# Altium schematic sheet MCU.SchDoc: Smart Bus Ticketing Machine/MCU
size A4; Date: 3/10/2025; CheckedBy: Kiran Gunathilaka; Author: Kiran Gunathilaka; DrawnBy: Kiran Gunathilaka; DocumentNumber: 02; Revision: v1.1; SheetNumber: 2; SheetTotal: 11
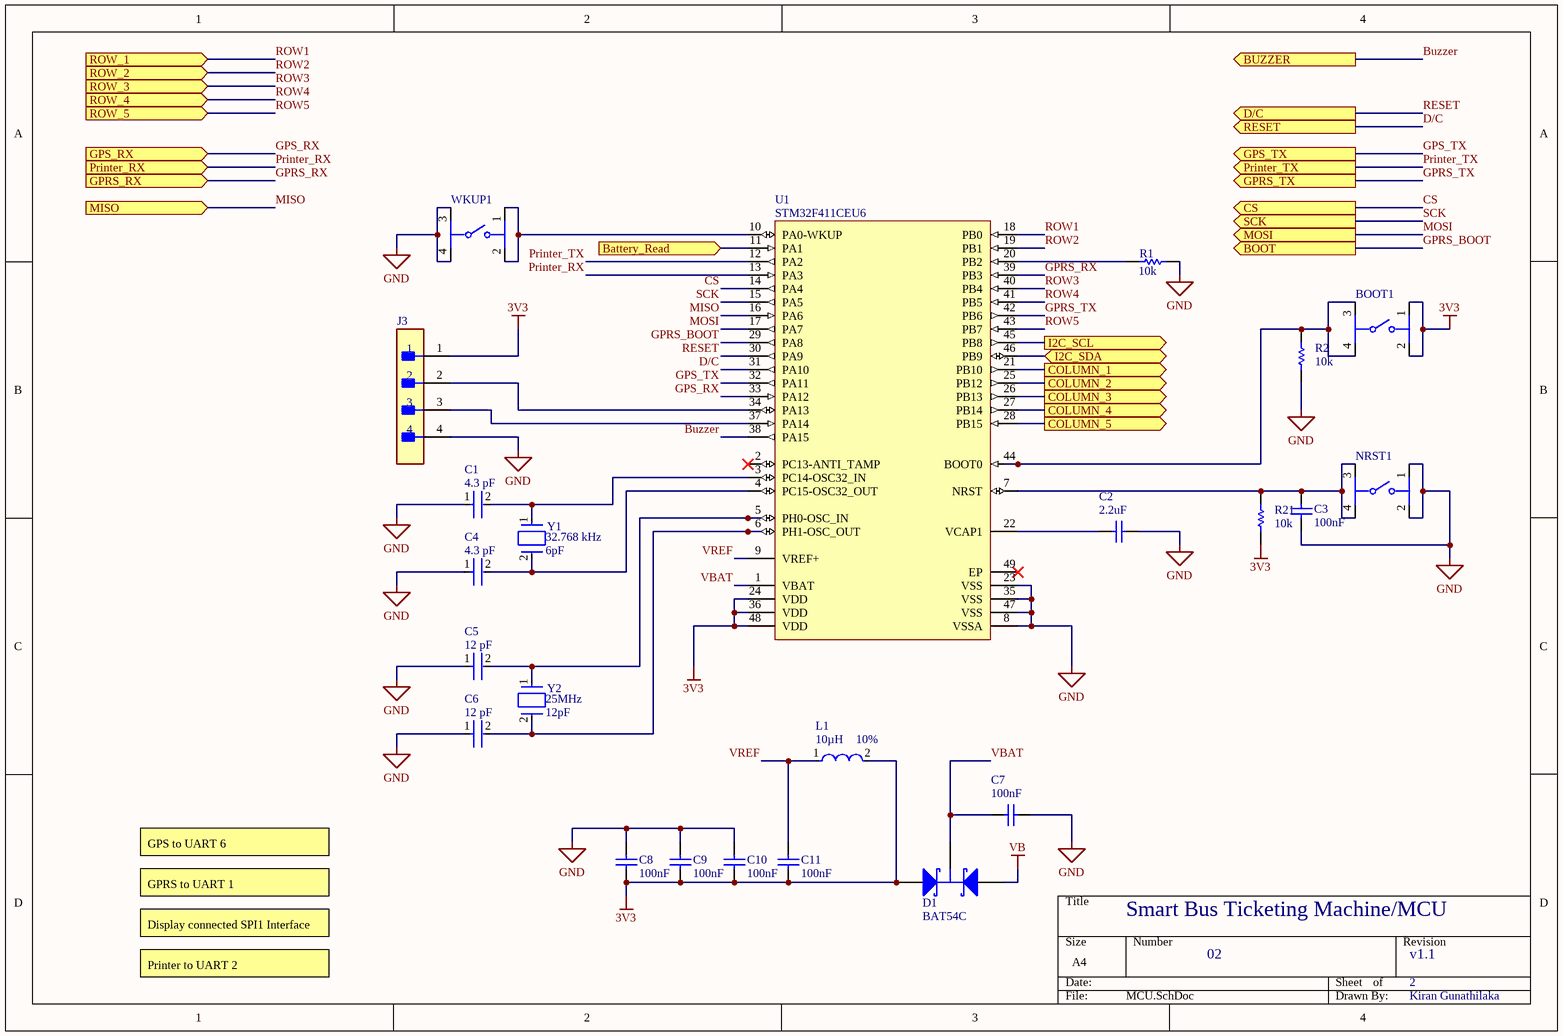
[diagram p0: MCU.SchDoc]

## Parts
BOOT1  PTS645SM43SMTR92LFS  [FP-PTS645SM43SMTR92LFS-MFG]  (value not drawn)
C1  Capacitance: 4.3 pF  [FP-C0805C-DN-MFG]  (hidden comment: C0805C439C5GACTU)
C2  value 2.2uF  [CAPC2013X145X50ML20T25]  (hidden comment: C0805C225K9PACTU)
C3  value 100nF  [CAPC2013X94X50ML20T25]  (hidden comment: 08051C152KAT2A)
C4  Capacitance: 4.3 pF  [FP-C0805C-DN-MFG]  (hidden comment: C0805C439C5GACTU)
C5  Capacitance: 12 pF  [FP-C0805C-DN-MFG]  (hidden comment: C0805C120J5GACTU)
C6  Capacitance: 12 pF  [FP-C0805C-DN-MFG]  (hidden comment: C0805C120J5GACTU)
C7  value 100nF  [CAPC2013X94X50ML20T25]  (hidden comment: 08051C152KAT2A)
C8  value 100nF  [CAPC2013X94X50ML20T25]  (hidden comment: 08051C152KAT2A)
C9  value 100nF  [CAPC2013X94X50ML20T25]  (hidden comment: 08051C152KAT2A)
C10  value 100nF  [CAPC2013X94X50ML20T25]  (hidden comment: 08051C152KAT2A)
C11  value 100nF  [CAPC2013X94X50ML20T25]  (hidden comment: 08051C152KAT2A)
D1  BAT54C  [NXP-SOT23-3_V]
J3  B04B-XASK-1(LF)(SN)  [FP-B04B-XASK-1_LF_SN-MFG]  (value not drawn)
L1  Inductance: 10µH  Tolerance: 10%  [FP-IMC-1210-MFG]  (hidden comment: IMC1210ER100K)
NRST1  PTS645SM43SMTR92LFS  [FP-PTS645SM43SMTR92LFS-MFG]  (value not drawn)
R1  value 10k  [RESC2013X60X35NL10T20]  (hidden comment: RC0805FR-0710KL)
R2  value 10k  [RESC2013X60X35NL10T20]  (hidden comment: RC0805FR-0710KL)
R21  value 10k  [RESC2013X60X35NL10T20]  (hidden comment: RC0805FR-0710KL)
U1  STM32F411CEU6  [STM-UFQFPN48_L]
WKUP1  PTS645SM43SMTR92LFS  [FP-PTS645SM43SMTR92LFS-MFG]  (value not drawn)
Y1  Load Capacitance: 6pF  Operating Frequency: 32.768 kHz  [FP-ABS07-120-MFG]  (hidden comment: ABS07-120-32.768KHZ-T)
Y2  Frequency: 25MHz  Load Capacitance: 12pF  [FP-AA-MFG]  (hidden comment: AA-25.000MALE-T)

## Ports
Battery_Read (in, see Main[2B]), BOOT (out, see Main[2C], GPRS[1A]), BUZZER (out, see Main[3B], Buzzer[2B], Outputs[2B]), COLUMN_1 (out, see Main[2C], Keyboard[1A]), COLUMN_2 (out, see Main[2C], Keyboard[1A]), COLUMN_3 (out, see Main[2C], Keyboard[1A]), COLUMN_4 (out, see Main[2C], Keyboard[1A]), COLUMN_5 (out, see Main[2C], Keyboard[1A]), CS (out, see Main[3C], Display[2C], Outputs[2C]), D/C (out, see Main[3C], Display[2C], Outputs[2D]), GPRS_RX (in, see Main[2B]), GPRS_TX (out, see Main[2B]), GPS_RX (in, see Main[2B]), GPS_TX (out, see Main[2B]), I2C_SCL (out, see Main[2C], IMU[2B]), I2C_SDA (bidir, see Main[2C], IMU[2B]), MISO (in, see Main[3B], Display[3B], Outputs[4C]), MOSI (out, see Main[3C], Display[2C], Outputs[2D]), Printer_RX (in, see Main[3B]), Printer_TX (out, see Main[3B]), RESET (out, see Main[3C], Display[2C], Outputs[2D]), ROW_1 (in, see Main[2C], Keyboard[3B]), ROW_2 (in, see Main[2C], Keyboard[3B]), ROW_3 (in, see Main[2C], Keyboard[3C]), ROW_4 (in, see Main[2C], Keyboard[3C]), ROW_5 (in, see Main[2C], Keyboard[3D]), SCK (out, see Main[3B], Display[2C], Outputs[2C])

## Nets
3V3: BOOT1.1 BOOT1.2 C8.1 C9.1 C10.1 C11.1 D1.1(A) J3.1 L1.2 R21.1 U1.24(VDD) U1.36(VDD) U1.48(VDD)
GND: C1.1 C2.2 C3.1 C4.1 C5.1 C6.1 C7.2 C8.2 C9.2 C10.2 J3.4 NRST1.1 NRST1.2 R1.1 R2.1 U1.8(VSSA) U1.23(VSS) U1.35(VSS) U1.47(VSS) WKUP1.3 WKUP1.4
VB: D1.2(A)
Battery_Read: U1.11(PA1) ; port Battery_Read
Buzzer: U1.38(PA15) ; port BUZZER
COLUMN_1: U1.21(PB10) ; port COLUMN_1
COLUMN_2: U1.25(PB12) ; port COLUMN_2
COLUMN_3: U1.26(PB13) ; port COLUMN_3
COLUMN_4: U1.27(PB14) ; port COLUMN_4
COLUMN_5: U1.28(PB15) ; port COLUMN_5
CS: U1.14(PA4) ; port CS
D/C: U1.31(PA10) ; port RESET
GPRS_BOOT: U1.29(PA8) ; port BOOT
GPRS_RX: U1.39(PB3) ; port GPRS_RX
GPRS_TX: U1.42(PB6) ; port GPRS_TX
GPS_RX: U1.33(PA12) ; port GPS_RX
GPS_TX: U1.32(PA11) ; port GPS_TX
I2C_SCL: U1.45(PB8) ; port I2C_SCL
I2C_SDA: U1.46(PB9) ; port I2C_SDA
MISO: U1.16(PA6) ; port MISO
MOSI: U1.17(PA7) ; port MOSI
Printer_RX: U1.13(PA3) ; port Printer_RX
Printer_TX: U1.12(PA2) ; port Printer_TX
RESET: U1.30(PA9) ; port D/C
ROW1: U1.18(PB0) ; port ROW_1
ROW2: U1.19(PB1) ; port ROW_2
ROW3: U1.40(PB4) ; port ROW_3
ROW4: U1.41(PB5) ; port ROW_4
ROW5: U1.43(PB7) ; port ROW_5
SCK: U1.15(PA5) ; port SCK
VBAT: C7.1 D1.3(K) U1.1(VBAT)
VREF: C11.2 L1.1 U1.9(VREF+)
NetBOOT1_3: BOOT1.3 BOOT1.4 R2.2 U1.44(BOOT0)
NetC1_2: C1.2 U1.3(PC14-OSC32_IN) Y1.1
NetC2_1: C2.1 U1.22(VCAP1)
NetC3_2: C3.2 NRST1.3 NRST1.4 R21.2 U1.7(NRST)
NetC4_2: C4.2 U1.4(PC15-OSC32_OUT) Y1.2
NetC5_2: C5.2 U1.5(PH0-OSC_IN) Y2.1
NetC6_2: C6.2 U1.6(PH1-OSC_OUT) Y2.2
NetJ3_2: J3.2 U1.34(PA13)
NetJ3_3: J3.3 U1.37(PA14)
NetR1_2: R1.2 U1.20(PB2)
NetU1_10: U1.10(PA0-WKUP) WKUP1.1 WKUP1.2

Not connected (* = marked no-connect by the designer): U1 2(PC13-ANTI_TAMP)* 49(EP)*

## Notes on the sheet
- GPS to UART 6
- GPRS to UART 1
- Display connected SPI1 Interface
- Printer to UART 2

## Library data of the parts
BOOT1 NRST1 WKUP1 = CMP-2000-05160-2: SWITCH TACTILE SPST-NO 0.05A 12V; Contact Resistance: 100mR; Throw Configuration: SPST; Illumination Type: Non-Illuminated; Mechanical Life: 100000Cycles; Current Rating: 50mA; Switch Function: Off-Mom; Actuator Length: 0.85mm; Actuator Material: Nylon; Actuator Type: Standard; Operating Force: 160gf; Min Operating Temperature: -20°C; REACH SVHC: No SVHC; Termination: Gull Wing; Case/Package: SMD/SMT; Packaging: Tape and Reel; Mount: Surface Mount; Voltage Rating (DC): 12V; Orientation: Straight; Lead Free: Lead Free; Contact Material: Silver; Color: Black; Max Current Rating: 50mA; Contact Plating: Silver; Depth: 9mm; Package Quantity: 1; Max Voltage Rating (DC): 12V; Length: 6mm; Max Operating Temperature: 60°C
C1 C4 = CMP-03020-016664-1: CAP CER 4.3PF 50V NP0 0805; Manufacturer: KEMET; Tolerance: 0.25 pF; Temperature Characteristic: C0G; Temperature Coefficient: 30ppm/°C; Material: Ceramic; Octopart: https://octopart.com/c0805c439c5gactu-kemet-9144293; Automotive: No; Height: 0.88mm; Device Class L1: Passive Components; ComponentLink2URL: https://content.kemet.com/datasheets/KEM_C1003_C0G_SMD.pdf; RoHS: TRUE; Temperature Range Low: -55°C; Temperature Range High: +125°C; Mouser Description: Multilayer Ceramic Capacitors MLCC - SMD/SMT 50volts 4.3pF C0G 0.25%; Digikey Description: CAP CER 4.3PF 50V NP0 0805; Temperature: -55°C to +125°C; Ipc Land Pattern Name: CAPC200125X78; Value: 4.3 pF; Device Class L2: Capacitors; Device Class L3: Ceramic Capacitors; Package: C0805C-DN; Voltage Rating: 50 V; ComponentLink2Description: Datasheet; Lead Free: Yes; Category: Cap; Manufacturer Part Number: C0805C439C5GACTU
C2 = CMP-1036-04819-2: Manufacturer: Kemet; Part Number: C0805C225K9PACTU
C3 C7-C11 = CMP-2007-04179-1: Manufacturer: AVX Interconnect / Elco; Part Number: 08051C152KAT2A
C5 C6 = CMP-2007-00441-2: CAP CER 12PF 50V C0G/NP0 0805; Manufacturer: KEMET; Temperature Characteristic: C0G; Temperature Coefficient: 30ppm/°C; Material: Ceramic; Tolerance: 0.05; Height: 0.88mm; ComponentLink2URL: https://content.kemet.com/datasheets/KEM_C1003_C0G_SMD.pdf; Automotive: No; Device Class L2: Capacitors; Digikey Description: CAP CER 12PF 50V C0G/NP0 0805; Value: 12 pF; Device Class L3: Ceramic Capacitors; Voltage Rating: 50 V; Mouser Description: Multilayer Ceramic Capacitors MLCC - SMD/SMT 50volts 12pF C0G 5%; Device Class L1: Passive Components; ComponentLink2Description: Datasheet; RoHS: TRUE; Temperature Range High: +125°C; Lead Free: Yes; Category: Cap; Ipc Land Pattern Name: CAPC200125X78; Package: C0805C-DN; Manufacturer Part Number: C0805C120J5GACTU; Octopart: https://octopart.com/c0805c120j5gactu-kemet-126518; Temperature Range Low: -55°C; Temperature: -55°C to +125°C
D1 = CMP-0417-00003-1: Schottky Barrier Diode, 30 V, 2 uA, -55 to 150 degC, 3-Pin SOT23, RoHS, Tape and Reel; Manufacturer: NXP Semiconductors; IR (uA): 2; VF (mV): 800; Trr (ns): 5; Cd (pF): 10; VR (V): 30; Rth(j-a) (K/W): 500; RoHS: TRUE; Packing: Tape and Reel; ComponentLink2URL: http://www.nxp.com/documents/data_sheet/BAT54_SER.pdf; PartNumber: BAT54C; ComponentLink2Description: Datasheet; Temperature Range: -55 to 150 degC; PackageReference: SOT23-3; PackageDescription: 3-Pin Plastic Surface-mounted Package, Body 1.3 x 2.9 mm, Pitch 0.95 mm; Mounting Technology: Surface Mount; ComponentLink1URL: http://www.nxp.com/; DatasheetVersion: Rev. 5; ComponentLink1Description: Manufacturer URL
J3 = CMP-17439-000018-1: CONN HEADER VERT 4POS 2.5MM; Manufacturer: JST; Current Rating: 3A; Voltage Rating: 250V; Conn Orientation: Straight; Conn Gender: Male; Number Of Contacts: 4; ComponentLink2Description: Datasheet; Package: B04B-XASK-1(LF)(SN); Octopart: https://octopart.com/b04b-xask-1%28lf%29%28sn%29-jst-3990149; Pitch: 2.5mm; Device Class L1: Connectors; RoHS: TRUE; Device Class L3: unset; Manufacturer Part Number: B04B-XASK-1(LF)(SN); Temperature Range High: +85°C; Height: 8.8mm; Lead Free: Yes; Category: Conn; Temperature: -25°C to +85°C; Digikey Description: CONN HEADER VERT 4POS 2.5MM; Temperature Range Low: -25°C; ComponentLink2URL: http://www.jst-mfg.com/product/pdf/eng/eXA1.pdf; Contact Material: Tin,Copper; Device Class L2: Headers and Wire Housings; Automotive: No; Number Of Rows: 1
L1 = CMP-00030-39678477-1: IMC1210ER100K Inductor Chip Molded Wirewound 10uH 10% 2.52MHz 30Q-Factor Powdered Iron 189mA 2.1Ohm DCR 1210 T/R; Self Resonant Frequency: 33MHz; Core Material: Ceramic, Ferrite; DC Resistance (DCR): 2.1Ω; Current: 290mA; Q Factor: 30; Shielding: Unshielded; Depth: 2.69mm; Termination: SMD/SMT; Test Frequency: 2.52MHz; DC Current: 189mA; Packaging: Cut Tape; Case Code (Metric): 3225; Case/Package: 1210; Length: 3.2004mm; Current Rating: 189mA; Lead Free: Lead Free; Weight: 15.989131mg; Width: 2.49mm; Mount: Surface Mount; Max DC Current: 189mA; Composition: Wirewound; RoHS: Compliant; Case Code (Imperial): 1210; Height: 2.21mm; Min Operating Temperature: -55°C; Radiation Hardening: No; Military Standard: Not; Inductance Tolerance: 10%; Max Operating Temperature: 125°C; Schedule B: 8504500000, 8504500000; REACH SVHC: Unknown; Height - Seated (Max): 2.413mm; Number of Pins: 2; NexarPartId: 39678477
R1 R2 R21 = CMP-1659-00013-4: Chip Resistor, 10 KOhm, +/- 1%, 0.125 W, -55 to 155 degC, 0805 (2012 Metric), RoHS, Tape and Reel; Manufacturer: Yageo; Voltage Rating: 150 V; Mount: Surface Mount; ComponentLink1Description: Manufacturer URL; ComponentLink2URL: http://www.yageo.com/documents/recent/PYu-RC_Group_51_RoHS_L_04.pdf; Pins: 2; Length: 2 mm; Min Operating Temperature: -55 degC; Height: 0.5 mm; Mounting Technology: Surface Mount; RoHSCompliant: true; REACH SVHC: No SVHC; ComponentLink1URL: http://www.yageo.com/; Max Operating Temperature: 155 degC; PackageReference: 0805; DatasheetVersion: Rev. 4, 02/2016; Package Quantity: 5000; Packaging: Tape and Reel; ComponentLink2Description: Datasheet; PackageDescription: 2-Pin Surface Mounted Device, Body 2 x 1.25 mm
U1 = CMP-0243-00165-1: ARM Cortex-M4 32-bit MCU+FPU, 512 KB Flash, 128 KB RAM, 36 I/Os, 48-Pin UFQFPN, -40 to 85 degC, Tray; Operating Frequency(F) (Processor speed) (MHz): 100; FLASH Size (Prog) (kB): 512; Internal RAM Size (kB): 128; I/Os (High Current): 36; Supply Voltage(Vcc) min (V): 1.7; Package Reference: 48-Pin Ultra Thin Fine Pitch Quad Flat No-Lead, 7 x 7 x 0.6 mm Body, 0.5 mm Pitch, Exposed Pad; ComponentLink1Description: Manufacturer URL; ComponentLink1URL: http://www.st.com/; Packing: Tray; Package Description: UFQFPN48; Core: ARM Cortex-M4; ComponentLink2Description: Datasheet; ComponentLink2URL: http://www.st.com/st-web-ui/static/active/en/resource/technical/document/datasheet/DM00115249.pdf; DatasheetVersion: Rev. 6; Mounting Technology: Surface Mount
Y1 = CMP-2000-07587-2: CRYSTAL 32.7680KHZ 6PF SMD; Frequency Tolerance: 20ppm; Series Resistance: 60kR; ESR (Equivalent Series Resistance): 55kR; Depth: 1.5mm; Width: 0.061inch; Number of Pins: 2; Max Operating Temperature: 85°C; Length: 3.2mm; Case/Package: SMD/SMT; Series: ABS07; Lead Free: Lead Free; Min Operating Temperature: -40°C; Packaging: Tape and Reel; Height: 0.035inch; Radiation Hardening: No; Tolerance: 20ppm; Termination: SMD/SMT; REACH SVHC: No SVHC; RoHS Compliant: Yes; Frequency: 32.768kHz; Package Quantity: 3000; Mount: Surface Mount
Y2 = CMP-18717-000190-1: CRYSTAL 25.0000MHZ 12PF SMD; Tolerance: 30ppm; Frequency Stability: 150ppm; ESR (Equivalent Series Resistance): 50R; Frequency Tolerance: 30ppm; Number of Pins: 2; Series: AA; Min Operating Temperature: -40°C; REACH SVHC: No SVHC; Length: 0.197inch; Package Quantity: 1000; Packaging: Tape and Reel; Termination: SMD/SMT; Case/Package: SMD/SMT; Max Operating Temperature: 125°C; Ratings: AEC-Q200; Height: 0.053inch; Width: 0.126inch; Mount: Surface Mount